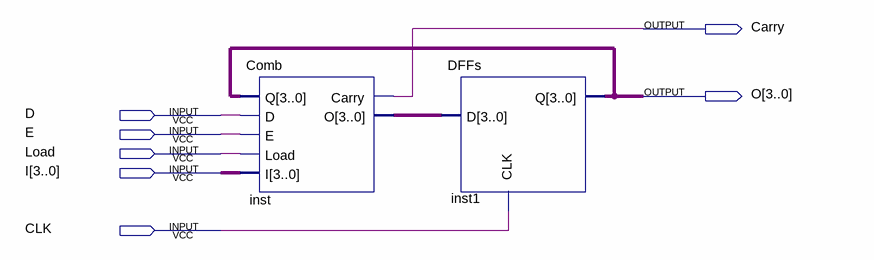
[diagram p0: schematic sheet]
// Quartus schematic BCD4bit.bdf as structural Verilog: 2 symbols, 7 pins
module BCD4bit (
  input  D,
  input  E,
  input  Load,
  input  [3:0] I,
  input  CLK,
  output Carry,
  output [3:0] O
);

  wire [3:0] inst_o;

  Comb inst (.Q(O), .D(D), .E(E), .Load(Load), .I(I), .Carry(Carry), .O(inst_o));
  DFFs inst1 (.D(inst_o), .CLK(CLK), .Q(O));
endmodule
